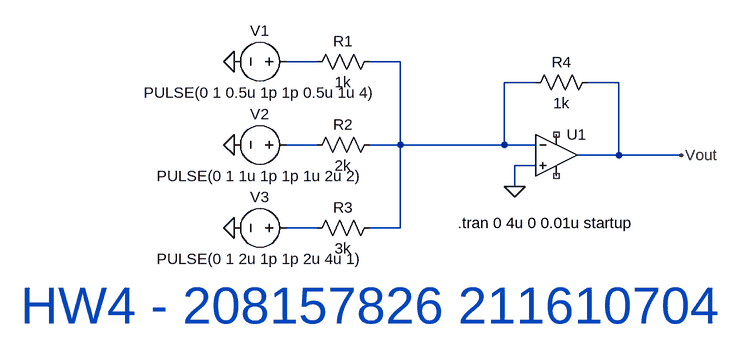
[diagram p0: schematic Q2_part_b.asc]
Q2_part_b.asc, the LTspice schematic file:
Version 4
SHEET 1 880 680
WIRE -32 64 -80 64
WIRE 96 64 48 64
WIRE 304 96 256 96
WIRE 432 96 384 96
WIRE -32 192 -80 192
WIRE 96 192 96 64
WIRE 96 192 48 192
WIRE 256 192 256 96
WIRE 256 192 96 192
WIRE 304 192 256 192
WIRE 432 208 432 96
WIRE 432 208 368 208
WIRE 528 208 432 208
WIRE 304 224 272 224
WIRE 272 256 272 224
WIRE -32 320 -80 320
WIRE 96 320 96 192
WIRE 96 320 48 320
FLAG -160 64 0
FLAG -160 192 0
FLAG -160 320 0
FLAG 272 256 0
FLAG 528 208 Vout
SYMBOL OpAmps\\UniversalOpAmp 336 208 R0
SYMATTR InstName U1
SYMBOL res 64 48 R90
WINDOW 0 0 56 VBottom 2
WINDOW 3 32 56 VTop 2
SYMATTR InstName R1
SYMATTR Value 1k
SYMBOL res 64 176 R90
WINDOW 0 0 56 VBottom 2
WINDOW 3 32 56 VTop 2
SYMATTR InstName R2
SYMATTR Value 2k
SYMBOL res 64 304 R90
WINDOW 0 0 56 VBottom 2
WINDOW 3 32 56 VTop 2
SYMATTR InstName R3
SYMATTR Value 3k
SYMBOL voltage -64 64 R90
WINDOW 0 -32 56 VBottom 2
WINDOW 3 32 56 VTop 2
WINDOW 123 0 0 Left 0
WINDOW 39 0 0 Left 0
SYMATTR InstName V1
SYMATTR Value PULSE(0 1 0.5u 1p 1p 0.5u 1u 4)
SYMBOL voltage -64 192 R90
WINDOW 0 -32 56 VBottom 2
WINDOW 3 32 56 VTop 2
SYMATTR InstName V2
SYMATTR Value PULSE(0 1 1u 1p 1p 1u 2u 2)
SYMBOL voltage -64 320 R90
WINDOW 0 -32 56 VBottom 2
WINDOW 3 32 56 VTop 2
SYMATTR InstName V3
SYMATTR Value PULSE(0 1 2u 1p 1p 2u 4u 1)
SYMBOL res 400 80 R90
WINDOW 0 0 56 VBottom 2
WINDOW 3 32 56 VTop 2
SYMATTR InstName R4
SYMATTR Value 1k
TEXT 184 312 Left 2 !.tran 0 4u 0 0.01u startup
TEXT -488 440 Left 6 ;HW4 - 208157826 211610704

The netlist it stands for:
* Q2_part_b.asc
XU1 0 N002 NC_01 NC_02 Vout level1 Avol=1Meg GBW=10Meg Vos=0 En=0 Enk=0 In=0 Ink=0 Rin=500Meg  ; pins In+ In- V+ V- OUT
R1 N002 N001 1k
R2 N002 N003 2k
R3 N002 N004 3k
V1 N001 0 PULSE(0 1 0.5u 1p 1p 0.5u 1u 4)
V2 N003 0 PULSE(0 1 1u 1p 1p 1u 2u 2)
V3 N004 0 PULSE(0 1 2u 1p 1p 2u 4u 1)
R4 Vout N002 1k
.tran 0 4u 0 0.01u startup
* HW4 - 208157826 211610704
.lib UniversalOpAmp1.lib
.backanno
.end